# EAGLE design 09B-10 (EAGLE 6.3)
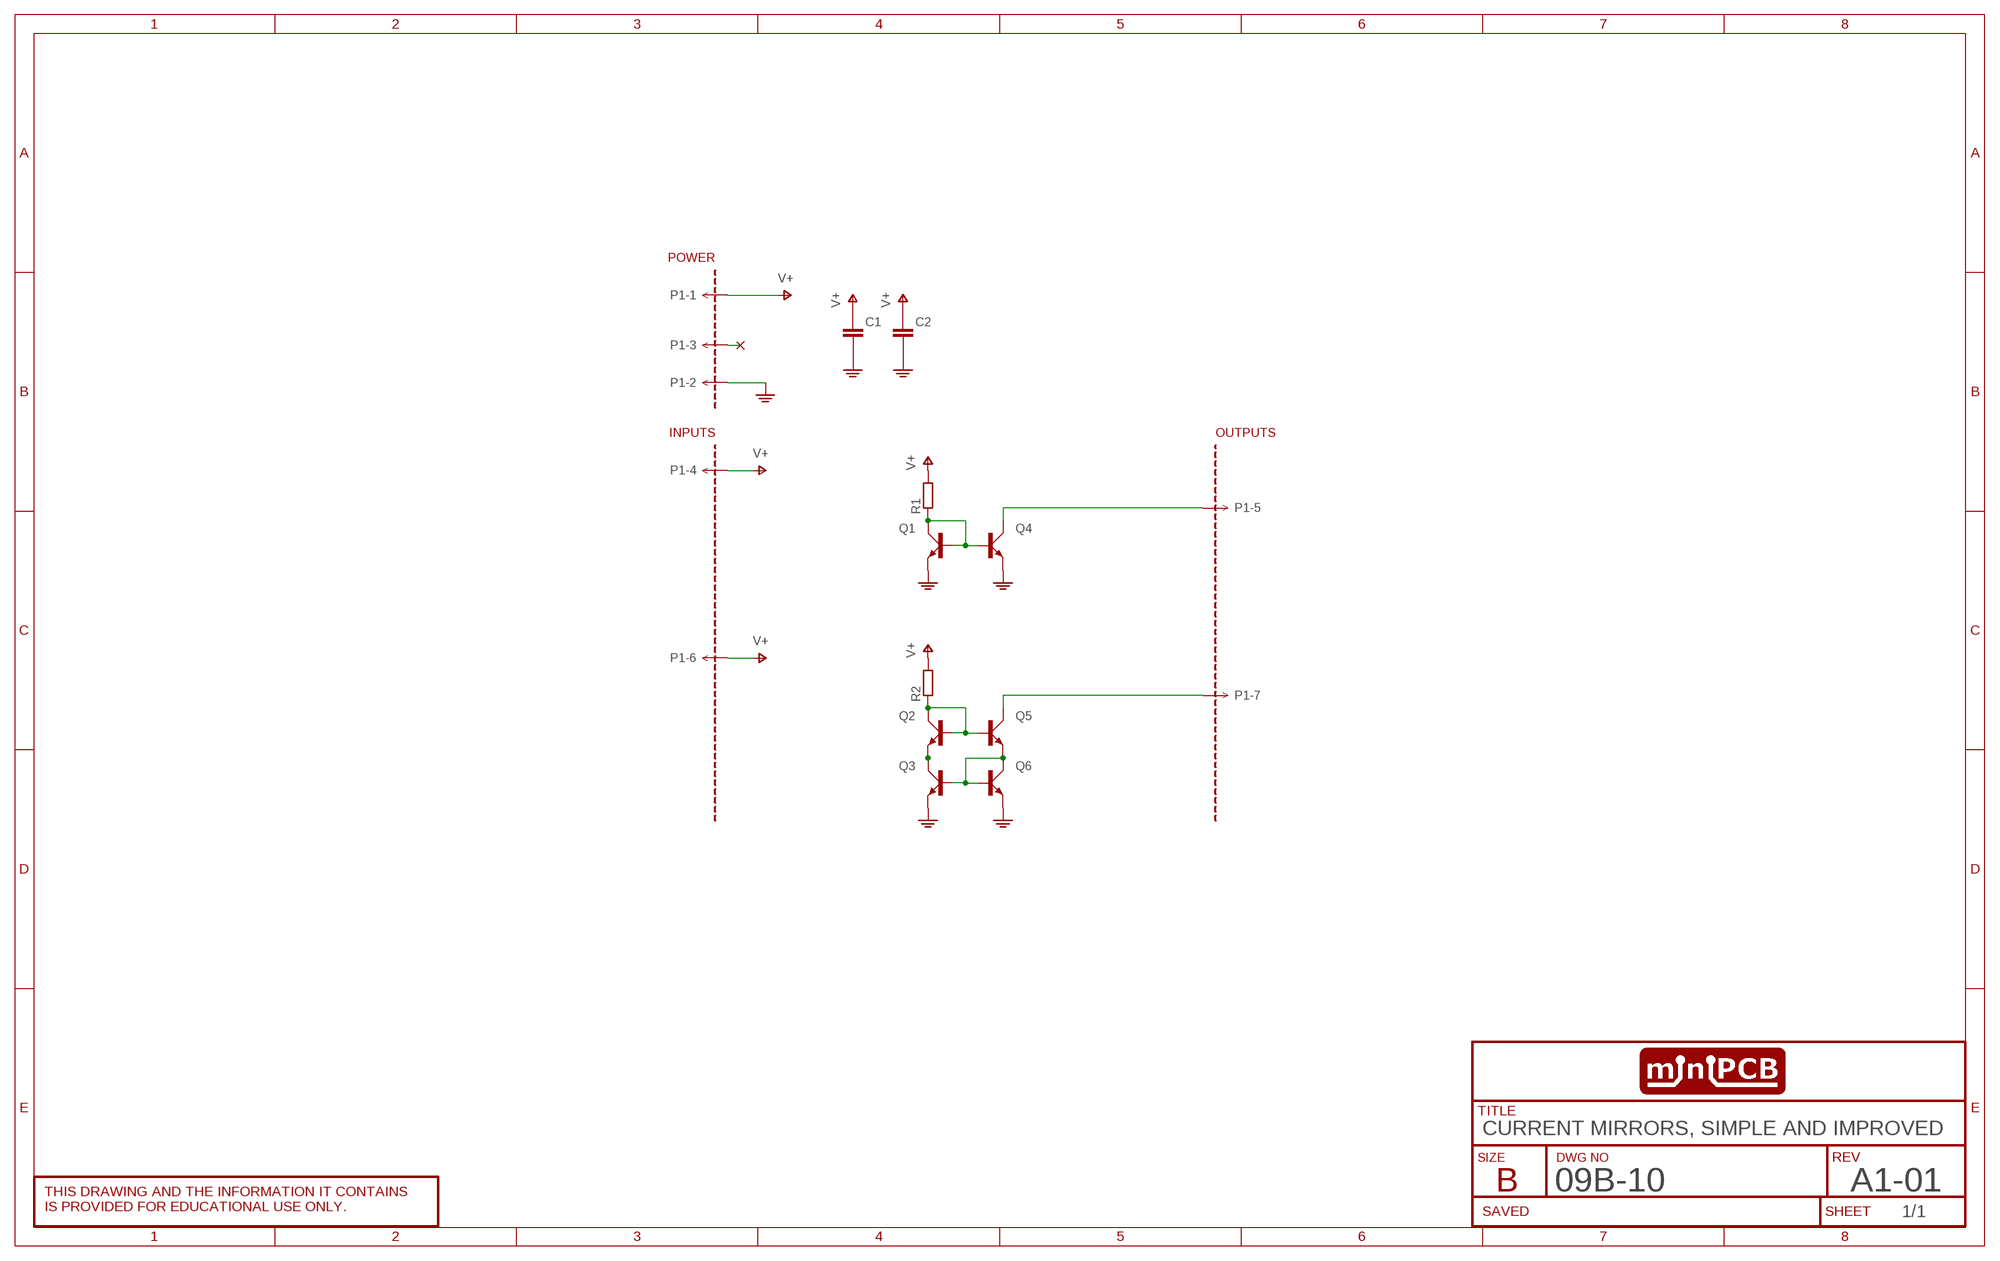
[diagram p0: schematic, sheet 1]
SHEET1 (SCHEMATIC): DWG_NO: 09B-10; REV: A1-01; TITLE: CURRENT MIRRORS, SIMPLE AND IMPROVED

## Parts
C1  CAPACITORSMD  [C0805]
C2  CAPACITORSMD  [C0805]
P1  MINIPCB_7P  [PINS_1X7]
PCB1  MINIPCB_0PPCB33  [PCB33]
Q1  BJT_NPNBEC  [SOT23]
Q2  BJT_NPNBEC  [SOT23]
Q3  BJT_NPNBEC  [SOT23]
Q4  BJT_NPNBEC  [SOT23]
Q5  BJT_NPNBEC  [SOT23]
Q6  BJT_NPNBEC  [SOT23]
R1  RESISTORSMD  [R0805]
R2  RESISTORSMD  [R0805]

## Nets
GND: C1.2ASDF(-) C2.2ASDF(-) P1.2 Q1.2(E) Q3.2(E) Q4.2(E) Q6.2(E)
N$1: Q1.1(B) Q1.3(C) Q4.1(B) R1.1
N$2: P1.5 Q4.3(C)
N$3: Q3.1(B) Q5.2(E) Q6.1(B) Q6.3(C)
N$4: Q2.1(B) Q2.3(C) Q5.1(B) R2.1
N$5: Q2.2(E) Q3.3(C)
N$7: P1.7 Q5.3(C)
N$8: P1.3
V+: C1.1ASD(+) C2.1ASD(+) P1.1 P1.4 P1.6 R1.2 R2.2

## Library data of the parts
C1 C2 = minipcb:CAPACITOR
P1 = minipcb:MINIPCB_7P
PCB1 = minipcb:MINIPCB_0P; PART_NUMBER: 09B-10; REVISION: A1-01; TITLE: CURRENT MIRRORS
Q1-Q6 = minipcb:BJT_NPN: TRANSISTOR
R1 R2 = minipcb:RESISTOR

## Board
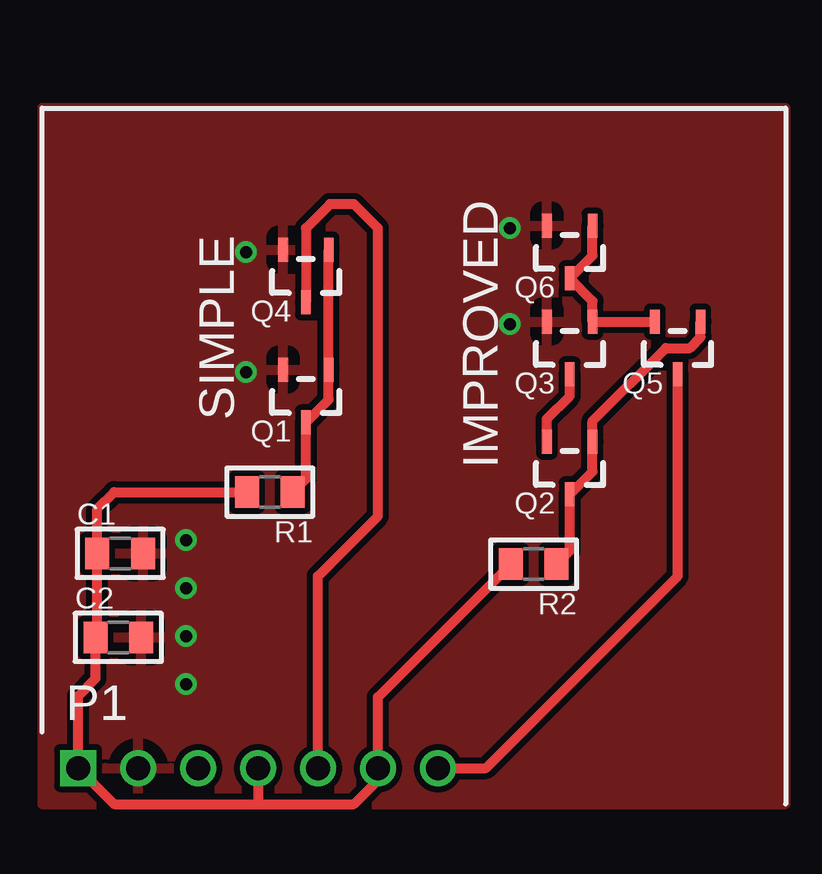
[diagram p1: board, top side]
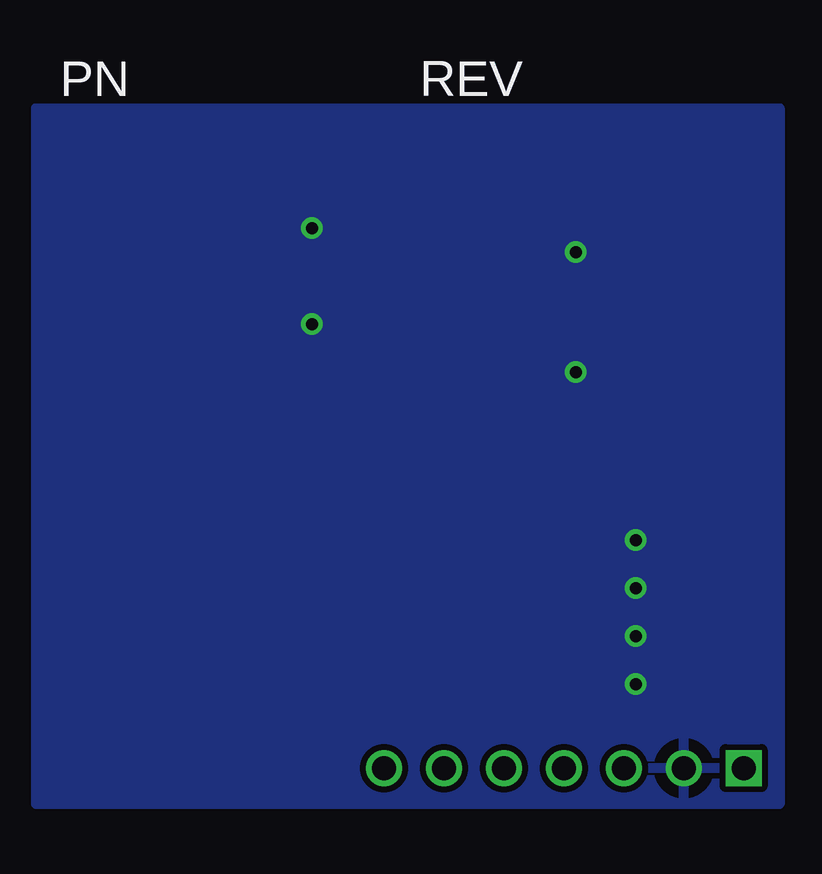
[diagram p2: board, bottom side, seen from below]

No outline drawn. Coordinates in mm, seen from the top.
Copper layers (1*16): Top 0.035mm / dielectric 1.5mm / Bottom 0.035mm
Design rules "minipcb *": minimum track width 0.2mm, minimum drill 0.5mm, track to track 0.25mm, track to pad 0.5mm, pad to pad 0.5mm, via to via 0.5mm, smd to smd 0.15mm, copper to edge 1mm, drill to drill 1mm, minimum pad ring 0.2mm, minimum via ring 0.2mm, stop-mask expansion 0.1mm, vias tented up to drill 0.6mm, thermal gap 0.5mm

### Footprints (pad centres in the part's own frame; a part is rotated, then mirrored left to right if it is on the bottom)
C0805 = smd 1 x 1.3: 1ASD -0.95,0; 2ASDF 0.95,0
PINS_1X7 = drill 1 square: 1 0,0 | drill 1: 2 2.5,0; 3 5,0; 4 7.5,0; 5 10,0; 6 12.5,0; 7 15,0
SOT23 = smd 0.4 x 1: 1 -0.95,-1.1; 2 0.95,-1.1; 3 0,1.1
R0805 = smd 1 x 1.3: 1 -0.95,0; 2 0.95,0

### Placement (x,y rotation side)
C1  4.26,11.44 0 top
C2  4.18,7.94 0 top
P1  2.5,2.5 0 top
PCB1  0,0 0 top
Q1  12,18 180 top
Q2  23,15 180 top
Q3  23,20 180 top
Q4  12,23 180 top
Q5  27.5,20 180 top
Q6  23,24 180 top
R1  10.5,14 180 top
R2  21.5,11 180 top

### Tracks (layer width: path | path; a pad name or v marks a point on that pad's centre or on a via)
GND  (via drill 0.5)
  other vias: 7,12 7,10 7,8 7,6 9.5,19 9.5,24 20.5,25 20.5,21
  pour Bottom: 1,1 32,1 32,30 1,30
  pour Top: 1,1 32,1 32,30 1,30
N$1
  Top 0.406: R1.1 12,14.55 Q1.3 12.95,17.85 Q1.1 Q4.1
N$2
  Top 0.406: P1.5 12.5,10.5 15,13 15,25 14,26 13,26 12,25 Q4.3
N$3
  Top 0.406: Q6.1 23.95,23.85 Q6.3 23.95,21.95 Q3.1 Q5.2
N$4
  Top 0.406: R2.1 23,11.55 Q2.3 23.95,14.85 Q2.1 23.95,16.95 27,20 28,20 28.45,20.45 Q5.1
N$5
  Top 0.406: Q2.2 22.05,17.05 23,18 Q3.3
N$7
  Top 0.406: P1.7 19.5,2.5 27.5,10.5 Q5.3
V+
  Top 0.406: R1.2 4,14 3.31,13.31 C1.1ASD 3.31,8.02 C2.1ASD 3.23,6.23 2.5,5.5 P1.1 4,1 10,1 | 10,1 14,1 15,2 P1.6 15,5.45 R2.2 | P1.4 10,1

### Text on the board
tPlace: SIMPLE | IMPROVED